# EAGLE design Lion1_2 (EAGLE 6.6.0)
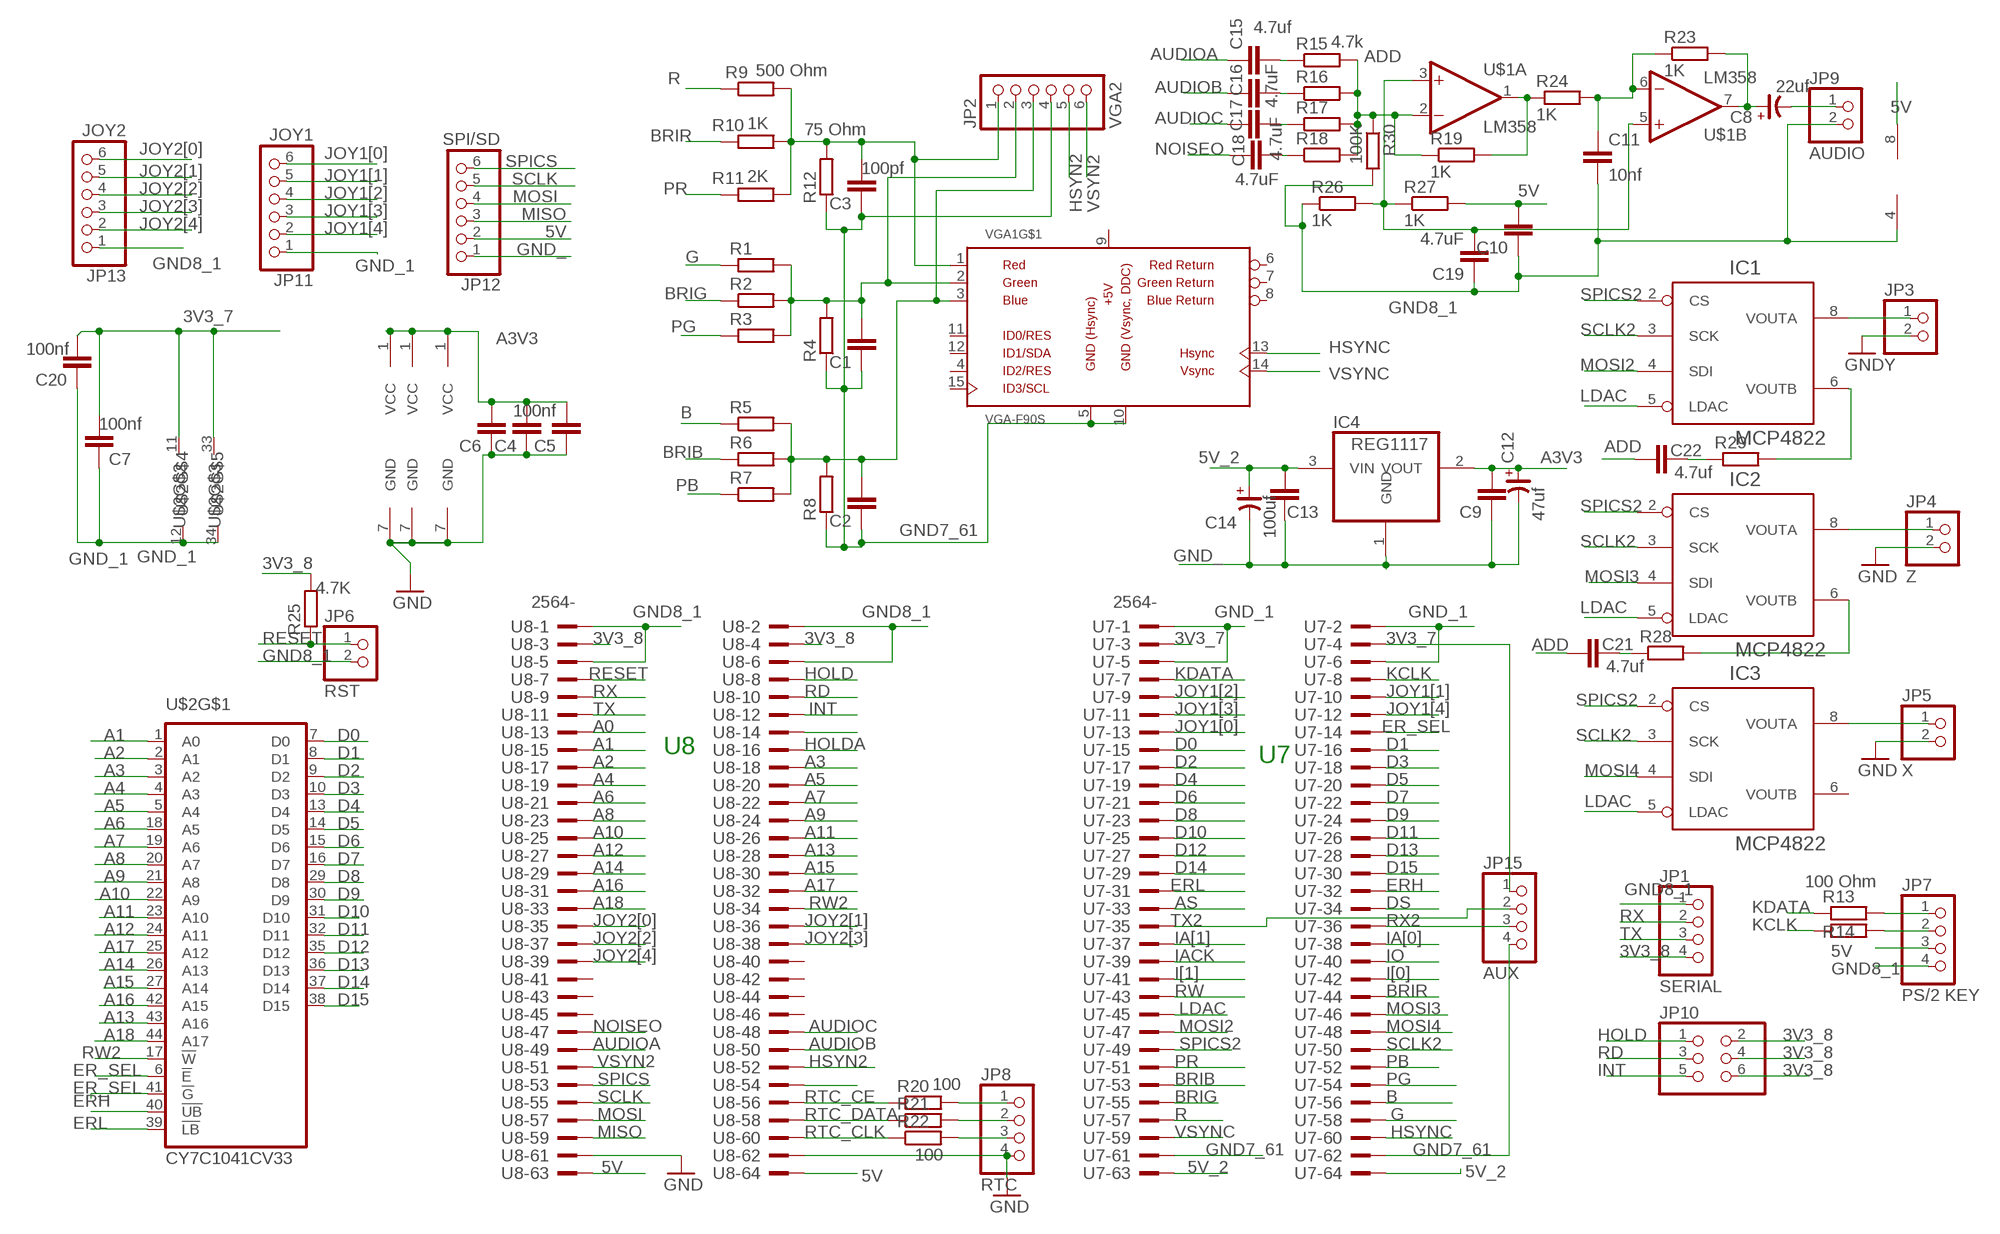
[diagram p0: schematic, sheet 1]

## Parts
C1  C-EU050-025X075  [C050-025X075]
C2  C-EU050-025X075  [C050-025X075]
C3  100pf  C-EU050-025X075  [C050-025X075]
C4  C-EU050-025X075  [C050-025X075]
C5  100nf  C-EU050-025X075  [C050-025X075]
C6  C-EU050-025X075  [C050-025X075]
C7  100nf  C-EUC0805  [C0805]
C8  22uf  CP_E-025X060  [CE-025X060]
C9  C-EU050-025X075  [C050-025X075]
C10  C-EU050-025X075  [C050-025X075]
C11  10nf  C-EU050-025X075  [C050-025X075]
C12  47uf  CP_E-025X060  [CE-025X060]
C13  C-EU050-025X075  [C050-025X075]
C14  100uf  CP_E-025X060  [CE-025X060]
C15  4.7uf  C-EU050-025X075  [C050-025X075]
C16  4.7uF  C-EU050-025X075  [C050-025X075]
C17  4.7uF  C-EU050-025X075  [C050-025X075]
C18  4.7uF  C-EU050-025X075  [C050-025X075]
C19  4.7uF  C-EU050-025X075  [C050-025X075]
C20  100nf  C-EUC0805  [C0805]
C21  4.7uf  C-EU050-025X075  [C050-025X075]
C22  4.7uf  C-EU050-025X075  [C050-025X075]
IC1  MCP4822  MCP42E-P  [DIL08]
IC2  MCP4822  MCP42E-P  [DIL08]
IC3  MCP4822  MCP42E-P  [DIL08]
IC4  REG1117  [SOT223]
JP1  SERIAL  PINHD-1X4  [1X04]
JP2  VGA2  PINHD-1X6  [1X06]
JP3  Y  PINHD-1X2  [1X02]
JP4  Z  PINHD-1X2  [1X02]
JP5  X  PINHD-1X2  [1X02]
JP6  RST  PINHD-1X2  [1X02]
JP7  PS/2 KEY  PINHD-1X4  [1X04]
JP8  RTC  PINHD-1X4  [1X04]
JP9  AUDIO  PINHD-1X2  [1X02]
JP10  PINHD-2X3  [2X03]
JP11  JOY1  PINHD-1X6  [1X06]
JP12  SPI/SD  PINHD-1X6  [1X06]
JP13  JOY2  PINHD-1X6  [1X06]
JP15  AUX  PINHD-1X4  [1X04]
R1  R-EU_0204/7  [0204/7]
R2  R-EU_0204/7  [0204/7]
R3  R-EU_0204/7  [0204/7]
R4  R-EU_0204/7  [0204/7]
R5  R-EU_0204/7  [0204/7]
R6  R-EU_0204/7  [0204/7]
R7  R-EU_0204/7  [0204/7]
R8  R-EU_0204/7  [0204/7]
R9  500 Ohm  R-EU_0204/7  [0204/7]
R10  1K  R-EU_0204/7  [0204/7]
R11  2K  R-EU_0204/7  [0204/7]
R12  75 Ohm  R-EU_0204/7  [0204/7]
R13  100 Ohm  R-EU_0204/7  [0204/7]
R14  R-EU_0204/7  [0204/7]
R15  4.7k  R-EU_0204/2V  [0204V]
R16  R-EU_0204/2V  [0204V]
R17  R-EU_0204/2V  [0204V]
R18  R-EU_0204/2V  [0204V]
R19  1K  R-EU_0204/7  [0204/7]
R20  100  R-EU_0204/7  [0204/7]
R21  100  R-EU_0204/7  [0204/7]
R22  R-EU_0204/7  [0204/7]
R23  1K  R-EU_0204/7  [0204/7]
R24  1K  R-EU_0204/7  [0204/7]
R25  4.7K  R-EU_0204/5  [0204/5]
R26  1K  R-EU_0204/7  [0204/7]
R27  1K  R-EU_0204/7  [0204/7]
R28  R-EU_0204/2V  [0204V]
R29  R-EU_0204/2V  [0204V]
R30  100K  R-EU_0204/7  [0204/7]
U7  2564-  [PAK100/2500-64]
U8  2564-  [PAK100/2500-64]
U$1  LM358  [DIL8]
U$2  CY7C1041CV33  [TSOP44-II]
VGA1  VGA-F90S  [DB-15-F90+SHIELD-SMALL_PADS]

## Nets
3V3_7: C7.2 C20.2 JP15.1 U7.3 U7.4 U$2.11(VCC) U$2.33(VCC)
3V3_8: JP1.4 JP10.2 JP10.4 JP10.6 R25.2 U8.3 U8.4
5V: C10.2 JP7.3 JP12.2 R27.2 U8.63 U8.64 U$1.8(P:V+)
5V_2: C13.2 C14.+ IC4.3(VIN) U7.63 U7.64
A0: U8.13
A1: U8.15 U$2.1(A0)
A2: U8.17 U$2.2(A1)
A3: U8.18 U$2.3(A2)
A3V3: C4.2 C5.2 C6.2 C9.2 C12.+ IC1.1(VCC) IC2.1(VCC) IC3.1(VCC) IC4.2(VOUT)
A4: U8.19 U$2.4(A3)
A5: U8.20 U$2.5(A4)
A6: U8.21 U$2.18(A5)
A7: U8.22 U$2.19(A6)
A8: U8.23 U$2.20(A7)
A9: U8.24 U$2.21(A8)
A10: U8.25 U$2.22(A9)
A11: U8.26 U$2.23(A10)
A12: U8.27 U$2.24(A11)
A13: U8.28 U$2.43(A16)
A14: U8.29 U$2.26(A13)
A15: U8.30 U$2.27(A14)
A16: U8.31 U$2.42(A15)
A17: U8.32 U$2.25(A12)
A18: U8.33 U$2.44(A17)
ADD: C21.1 C22.1 R15.2 R16.2 R17.2 R18.2 R19.1 R30.1 U$1.2(A:-IN)
AS: U7.33
AUDIOA: C15.1 U8.49
AUDIOB: C16.1 U8.50
AUDIOC: C17.1 U8.48
B: R5.1 U7.56
BRIB: R6.1 U7.53
BRIG: R2.1 U7.55
BRIR: R10.1 U7.44
D0: U7.15 U$2.7(D0)
D1: U7.16 U$2.8(D1)
D2: U7.17 U$2.9(D2)
D3: U7.18 U$2.10(D3)
D4: U7.19 U$2.13(D4)
D5: U7.20 U$2.14(D5)
D6: U7.21 U$2.15(D6)
D7: U7.22 U$2.16(D7)
D8: U7.23 U$2.29(D8)
D9: U7.24 U$2.30(D9)
D10: U7.25 U$2.31(D10)
D11: U7.26 U$2.32(D11)
D12: U7.27 U$2.35(D12)
D13: U7.28 U$2.36(D13)
D14: U7.29 U$2.37(D14)
D15: U7.30 U$2.38(D15)
DS: U7.34
ER_SEL: U7.14 U$2.6(!E) U$2.41(!G)
ERH: U7.32 U$2.40(!UB)
ERL: U7.31 U$2.39(!LB)
G: R1.1 U7.58
GND7_61: C1.1 C2.1 C3.1 JP2.4 JP15.4 R4.1 R8.1 R12.1 U7.61 U7.62 VGA1.5(GND) VGA1.10(GND)
GND8_1: C10.1 C11.2 C19.1 JP1.1 JP6.2 JP7.4 JP9.2 JP13.1 R26.1 R30.2 U8.1 U8.2 U8.5 U8.6 U$1.4(P:V-)
GND_: C4.1 C5.1 C6.1 C9.1 C12.- C13.1 C14.- IC1.7(GND) IC2.7(GND) IC3.7(GND) IC4.1(GND) JP3.2 JP4.2 JP5.2 JP8.4 JP12.1 U8.61 U8.62 ; supply symbol labelled GND
GND_1: C7.1 C20.1 JP11.1 U7.1 U7.2 U7.5 U7.6 U$2.12(VSS) U$2.34(VSS)
HOLD: JP10.1 U8.8
HOLDA: U8.16
HSYN2: JP2.5 U8.52
HSYNC: U7.60 VGA1.13(VGA-HSYNC)
I[0]: U7.42
I[1]: U7.41
IA[0]: U7.38
IA[1]: U7.37
IACK: U7.39
INT: JP10.5 U8.12
IO: U7.40
JOY1[0]: JP11.6 U7.13
JOY1[1]: JP11.5 U7.10
JOY1[2]: JP11.4 U7.9
JOY1[3]: JP11.3 U7.11
JOY1[4]: JP11.2 U7.12
JOY2[0]: JP13.6 U8.35
JOY2[1]: JP13.5 U8.36
JOY2[2]: JP13.4 U8.37
JOY2[3]: JP13.3 U8.38
JOY2[4]: JP13.2 U8.39
KCLK: R14.1 U7.8
KDATA: R13.1 U7.7
LDAC: IC1.5(LDAC) IC2.5(LDAC) IC3.5(LDAC) U7.45
MISO: JP12.3 U8.59
MOSI: JP12.4 U8.57
MOSI2: IC1.4(SDI) U7.47
MOSI3: IC2.4(SDI) U7.46
MOSI4: IC3.4(SDI) U7.48
N$1: C1.2 JP2.2 R1.2 R2.2 R3.2 R4.2 VGA1.2(VGA-G)
N$2: IC2.6(VOUTB) R28.2
N$3: C19.2 R26.2 R27.1 U$1.3(A:+IN) U$1.5(B:+IN)
N$4: C15.2 R15.1
N$5: IC3.8(VOUTA) JP5.1
N$6: C2.2 JP2.3 R5.2 R6.2 R7.2 R8.2 VGA1.3(VGA-B)
N$7: IC2.8(VOUTA) JP4.1
N$8: IC1.8(VOUTA) JP3.1
N$9: C21.2 R28.1
N$10: C3.2 JP2.1 R9.2 R10.2 R11.2 R12.2 VGA1.1(VGA-R)
N$11: R19.2 R24.1 U$1.1(A:OUT)
N$12: JP7.1 R13.2
N$13: JP7.2 R14.2
N$14: C8.- JP9.1
N$15: JP8.1 R20.2
N$17: JP8.2 R21.2
N$18: JP8.3 R22.2
N$19: C8.+ R23.2 U$1.7(B:OUT)
N$20: C11.1 R23.1 R24.2 U$1.6(B:-IN)
N$21: C16.2 R16.1
N$22: C17.2 R17.1
N$23: C18.2 R18.1
N$25: C22.2 R29.1
N$26: IC1.6(VOUTB) R29.2
N$47: U8.14
N$66: U8.54
NOISEO: C18.1 U8.47
PB: R7.1 U7.52
PG: R3.1 U7.54
PR: R11.1 U7.51
R: R9.1 U7.57
RD: JP10.3 U8.10
RESET: JP6.1 R25.1 U8.7
RTC_CE: R20.1 U8.56
RTC_CLK: R22.1 U8.60
RTC_DATA: R21.1 U8.58
RW: U7.43
RW2: U8.34 U$2.17(!W)
RX: JP1.2 U8.9
RX2: JP15.3 U7.36
SCLK: JP12.5 U8.55
SCLK2: IC1.3(SCK) IC2.3(SCK) IC3.3(SCK) U7.50
SPICS: JP12.6 U8.53
SPICS2: IC1.2(CS) IC2.2(CS) IC3.2(CS) U7.49
TX: JP1.3 U8.11
TX2: JP15.2 U7.35
VSYN2: JP2.6 U8.51
VSYNC: U7.59 VGA1.14(VGA-VSYNC)
Unconnected: IC3.6(VOUTB) U8.40 U8.41 U8.42 U8.43 U8.44 U8.45 U8.46 VGA1.4(ID2/RES) VGA1.6(VGA-R-) VGA1.7(VGA-G-) VGA1.8(VGA-B-) VGA1.11(ID0/RES) VGA1.12(ID1/SDA) VGA1.15(ID3/SCL) VGA1.SHIELD@1(SHIELD) VGA1.SHIELD@2(SHIELD)

## Notes on the sheet
- U8
- U7

## Power pins joined to a net without a drawn wire
+5V: VGA1.9(+5V)

## Library data of the parts
C1-C7 C9-C11 C13 C15-C22 = rcl:C-EU: CAPACITOR, European symbol
C8 C12 C14 = rc-master:CP_: POLARIZED CAP
IC1-IC3 = dac:MCP4*2: DAC 8BIT DUAL SPI/VREF
IC4 = burr-brown:REG1117: 800mA and 1A Low Dropout (LDO) Positive Regulator 1.8V, 2.5V, 2.85V, 3.3V, 5V, and Adj; MPN: REG1117; OC_FARNELL: 1097566; OC_NEWARK: 14P6981
JP1 JP7 JP8 JP15 = pinhead:PINHD-1X4: PIN HEADER
JP2 JP11-JP13 = pinhead:PINHD-1X6: PIN HEADER
JP3-JP6 JP9 = pinhead:PINHD-1X2: PIN HEADER
JP10 = pinhead:PINHD-2X3: PIN HEADER
R1-R12 R25 = rcl:R-EU_: RESISTOR, European symbol
R13-R24 R26-R30 = SmartPrj:R-EU_: RESISTOR, European symbol
U7 U8 = con-3m:2564-: 3M (TM) Pak 100 4-Wall Header Source: 3M; OC_FARNELL: unknown; OC_NEWARK: unknown
U$1 = eagle-6.5.0-atari:LM358: Dual General Purpose, Rail-to-Rail Output Operational Amplifier
U$2 = st-microelectronics:CY7C1041CV33
VGA1 = VideoConnectors:VGA-*

## Board
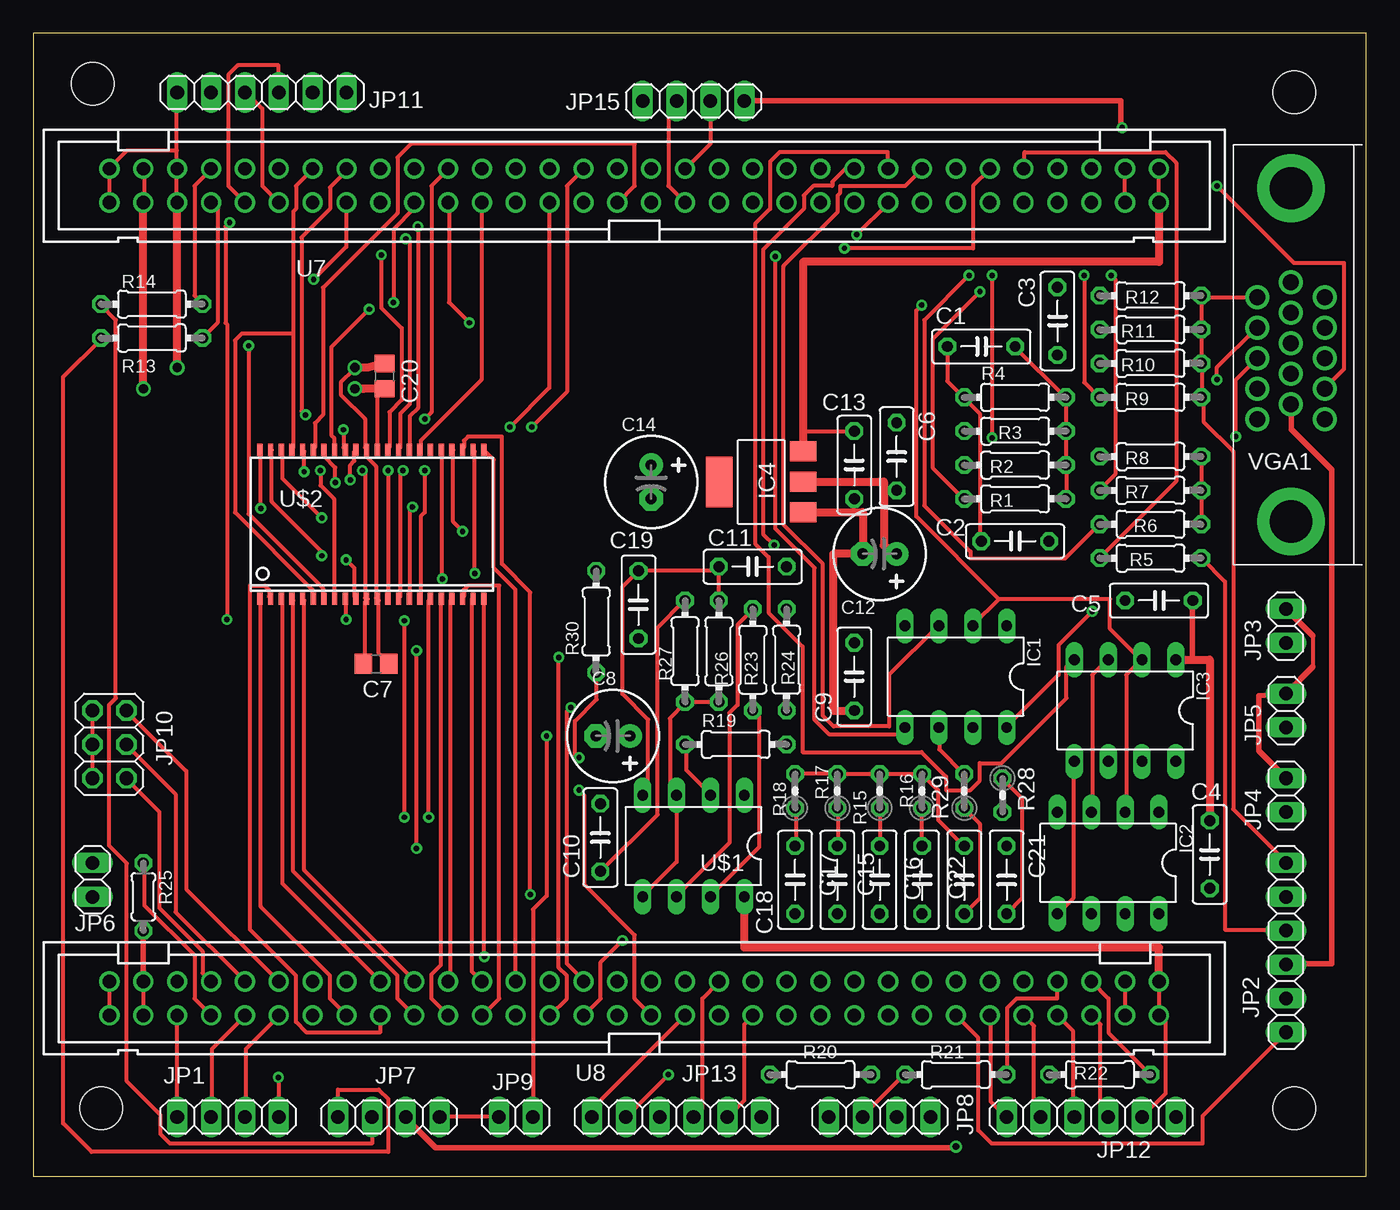
[diagram p1: board, top side]
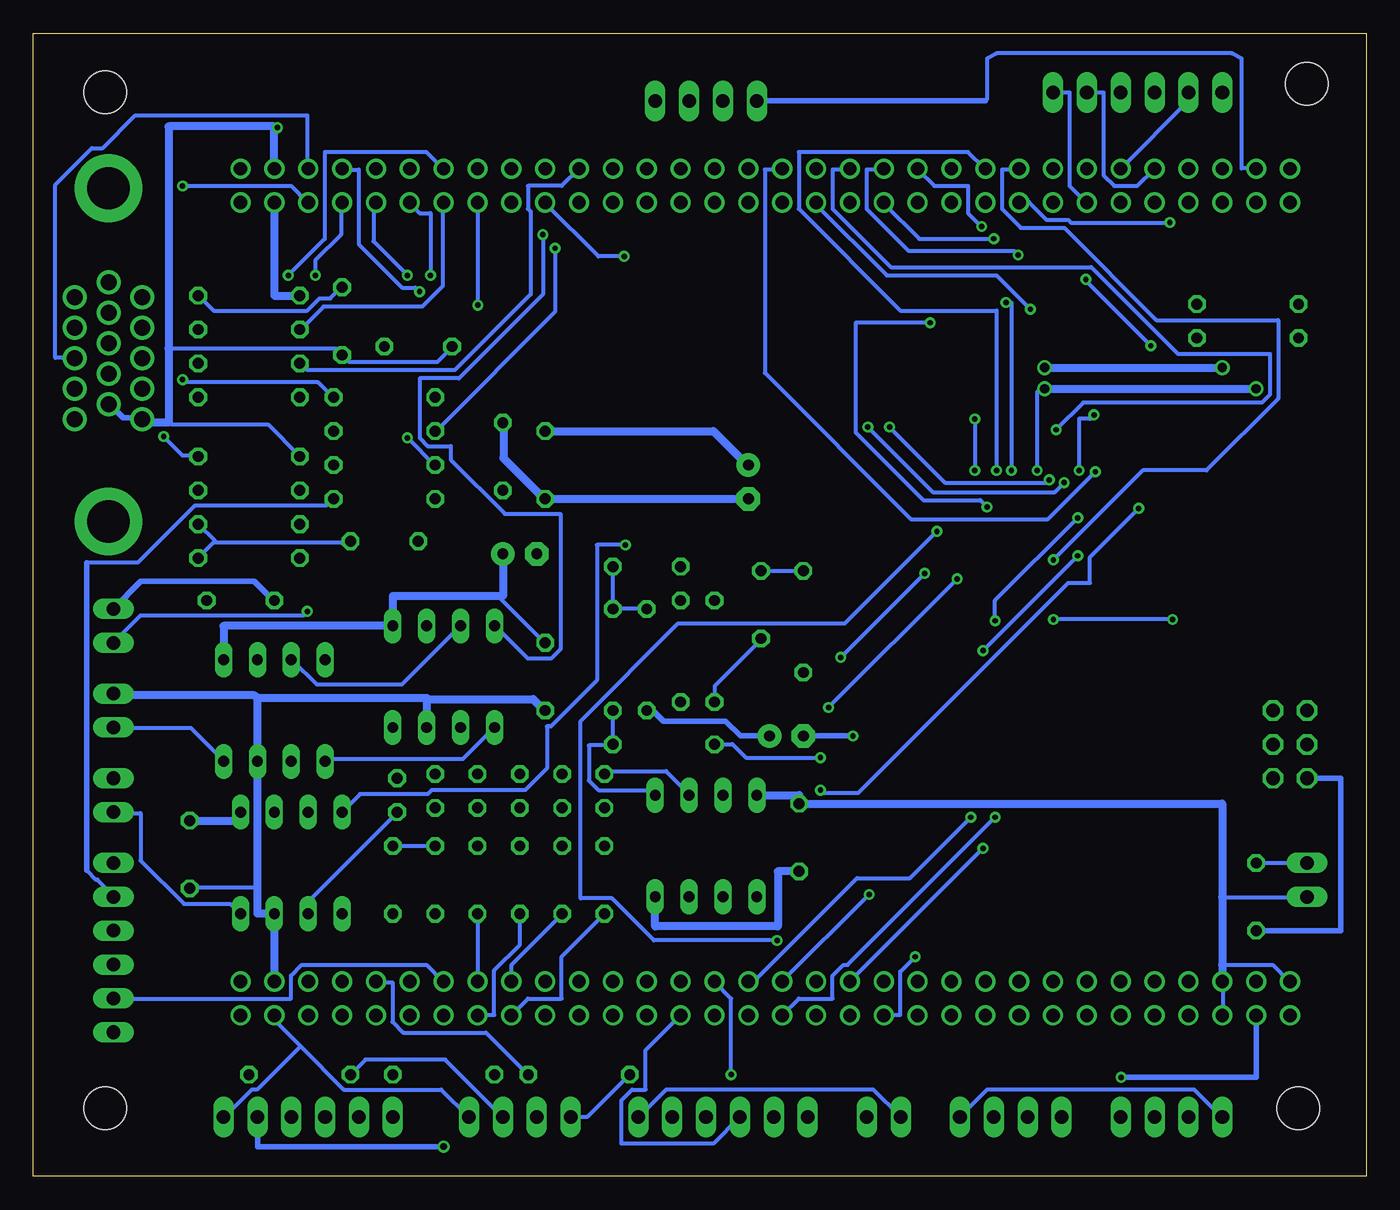
[diagram p2: board, bottom side, seen from below]

Size 100 x 85.72 mm. Coordinates in mm from the lower left corner, seen from the top.
Outline: 0,0 100,0 100,85.72 0,85.72 0,0
Copper layers (1*16): Top 0.035mm / dielectric 1.5mm / Bottom 0.035mm
Design rules "default *": minimum track width 12mil, minimum drill 16mil, track to track 12mil, track to pad 12mil, pad to pad 12mil, via to via 12mil, smd to smd 6mil, copper to edge 40mil, drill to drill 16mil, minimum pad ring 10mil, minimum via ring 8mil, stop-mask expansion 4mil, vias tented up to drill 0mil, thermal gap 10mil
Holes 3.2 mm at 94.61,81.28 94.61,5.08 4.45,81.92 5.08,5.08

### Footprints (pad centres in the part's own frame; a part is rotated, then mirrored left to right if it is on the bottom)
C050-025X075 = drill 0.813 octagon: 1 -2.54,0; 2 2.54,0
C0805 = smd 1.3 x 1.5: 1 -0.95,0; 2 0.95,0
CE-025X060 = drill 0.813 pad 1.778: + -1.27,0 | drill 0.813 pad 1.778 octagon: - 1.27,0
DIL08 = drill 0.813 long: 1 -3.81,-3.81; 2 -1.27,-3.81; 3 1.27,-3.81; 4 3.81,-3.81; 5 3.81,3.81; 6 1.27,3.81; 7 -1.27,3.81; 8 -3.81,3.81
SOT223 = smd 1.499 x 2.007: 1 -2.261,-3.15; 2 0.025,-3.15; 3 2.311,-3.15 | smd 3.81 x 2.007: 4 0,3.15
1X04 = drill 1.016 long: 1 -3.81,0; 2 -1.27,0; 3 1.27,0; 4 3.81,0
1X06 = drill 1.016 long: 1 -6.35,0; 2 -3.81,0; 3 -1.27,0; 4 1.27,0; 5 3.81,0; 6 6.35,0
1X02 = drill 1.016 long: 1 -1.27,0; 2 1.27,0
2X03 = drill 1.016 octagon: 1 -2.54,-1.27; 2 -2.54,1.27; 3 0,-1.27; 4 0,1.27; 5 2.54,-1.27; 6 2.54,1.27
0204/7 = drill 0.813 octagon: 1 -3.81,0; 2 3.81,0
0204V = drill 0.813 octagon: 1 -1.27,0; 2 1.27,0
0204/5 = drill 0.813 octagon: 1 -2.54,0; 2 2.54,0
PAK100/2500-64 = drill 1 pad 1.422: 1 -39.37,-1.27; 2 -39.37,1.27; 3 -36.83,-1.27; 4 -36.83,1.27; 5 -34.29,-1.27; 6 -34.29,1.27; 7 -31.75,-1.27; 8 -31.75,1.27; 9 -29.21,-1.27; 10 -29.21,1.27; 11 -26.67,-1.27; 12 -26.67,1.27; 13 -24.13,-1.27; 14 -24.13,1.27; 15 -21.59,-1.27; 16 -21.59,1.27; 17 -19.05,-1.27; 18 -19.05,1.27; 19 -16.51,-1.27; 20 -16.51,1.27; 21 -13.97,-1.27; 22 -13.97,1.27; 23 -11.43,-1.27; 24 -11.43,1.27; 25 -8.89,-1.27; 26 -8.89,1.27; 27 -6.35,-1.27; 28 -6.35,1.27; 29 -3.81,-1.27; 30 -3.81,1.27; 31 -1.27,-1.27; 32 -1.27,1.27; 33 1.27,-1.27; 34 1.27,1.27; 35 3.81,-1.27; 36 3.81,1.27; 37 6.35,-1.27; 38 6.35,1.27; 39 8.89,-1.27; 40 8.89,1.27; 41 11.43,-1.27; 42 11.43,1.27; 43 13.97,-1.27; 44 13.97,1.27; 45 16.51,-1.27; 46 16.51,1.27; 47 19.05,-1.27; 48 19.05,1.27; 49 21.59,-1.27; 50 21.59,1.27; 51 24.13,-1.27; 52 24.13,1.27; 53 26.67,-1.27; 54 26.67,1.27; 55 29.21,-1.27; 56 29.21,1.27; 57 31.75,-1.27; 58 31.75,1.27; 59 34.29,-1.27; 60 34.29,1.27; 61 36.83,-1.27; 62 36.83,1.27; 63 39.37,-1.27; 64 39.37,1.27
DIL8 = drill 0.813 long: 1 -3.81,-3.81; 2 -1.27,-3.81; 3 1.27,-3.81; 4 3.81,-3.81; 5 3.81,3.81; 6 1.27,3.81; 7 -1.27,3.81; 8 -3.81,3.81
TSOP44-II = smd 0.4 x 0.9: 1 -8.4,-5.6; 2 -7.6,-5.6; 3 -6.8,-5.6; 4 -6,-5.6; 5 -5.2,-5.6; 6 -4.4,-5.6; 7 -3.6,-5.6; 8 -2.8,-5.6; 9 -2,-5.6; 10 -1.2,-5.6; 11 -0.4,-5.6; 12 0.4,-5.6; 13 1.2,-5.6; 14 2,-5.6; 15 2.8,-5.6; 16 3.6,-5.6; 17 4.4,-5.6; 18 5.2,-5.6; 19 6,-5.6; 20 6.8,-5.6; 21 7.6,-5.6; 22 8.4,-5.6; 23 8.4,5.6; 24 7.6,5.6; 25 6.8,5.6; 26 6,5.6; 27 5.2,5.6; 28 4.4,5.6; 29 3.6,5.6; 30 2.8,5.6; 31 2,5.6; 32 1.2,5.6; 33 0.4,5.6; 34 -0.4,5.6; 35 -1.2,5.6; 36 -2,5.6; 37 -2.8,5.6; 38 -3.6,5.6; 39 -4.4,5.6; 40 -5.2,5.6; 41 -6,5.6; 42 -6.8,5.6; 43 -7.6,5.6; 44 -8.4,5.6
DB-15-F90+SHIELD-SMALL_PADS = drill 1.2 pad 1.524: 1 4.318,14.224; 2 2.032,14.224; 3 -0.254,14.224; 4 -2.54,14.224; 5 -4.826,14.224; 6 5.461,11.684; 7 3.175,11.684; 8 0.889,11.684; 9 -1.397,11.684; 10 -3.683,11.684; 11 4.318,9.144; 12 2.032,9.144; 13 -0.254,9.144; 14 -2.54,9.144; 15 -4.826,9.144 | drill 3.175 pad 5.08: SHIELD@1 -12.497,11.684; SHIELD@2 12.497,11.684

### Placement (x,y rotation side)
C1  71.12,62.23 0 top
C2  73.66,47.62 0 top
C3  76.83,64.14 90 top
C4  88.27,24.13 90 top
C5  84.45,43.18 0 top
C6  64.77,53.98 270 top
C7  25.72,38.42 180 top
C8  43.5,33.02 180 top
C9  61.59,37.47 90 top
C10  42.55,25.4 270 top
C11  53.98,45.72 180 top
C12  63.5,46.67 180 top
C13  61.59,53.34 90 top
C14  46.35,52.07 270 top
C15  63.5,22.23 90 top
C16  66.67,22.23 90 top
C17  60.33,22.23 90 top
C18  57.15,22.23 90 top
C19  45.4,42.86 270 top
C20  26.35,60.01 270 top
C21  73.03,22.23 270 top
C22  69.85,22.23 270 top
IC1  69.22,37.47 180 top
IC2  80.64,23.5 180 top
IC3  81.92,34.92 180 top
IC4  54.61,52.07 90 top
JP1  14.61,4.45 0 top
JP2  93.98,17.14 270 top
JP3  93.98,41.27 90 top
JP4  93.98,28.57 90 top
JP5  93.98,34.92 90 top
JP6  4.45,22.23 270 top
JP7  26.67,4.45 0 top
JP8  63.5,4.45 0 top
JP9  36.2,4.45 180 top
JP10  5.71,32.38 90 top
JP11  17.14,81.28 0 top
JP12  79.38,4.45 180 top
JP13  48.26,4.45 180 top
JP15  49.53,80.64 0 top
R1  73.66,50.8 0 top
R2  73.66,53.34 0 top
R3  73.66,55.88 0 top
R4  73.66,58.42 0 top
R5  83.82,46.35 0 top
R6  83.82,48.9 0 top
R7  83.82,51.44 0 top
R8  83.82,53.98 0 top
R9  83.82,58.42 0 top
R10  83.82,60.96 0 top
R11  83.82,63.5 0 top
R12  83.82,66.04 0 top
R13  8.89,62.87 180 top
R14  8.89,65.41 180 top
R15  63.5,28.89 90 top
R16  66.67,28.89 90 top
R17  60.33,28.89 90 top
R18  57.15,28.89 90 top
R19  52.7,32.38 0 top
R20  59.05,7.62 180 top
R21  69.22,7.62 180 top
R22  80.01,7.62 180 top
R23  53.98,38.73 270 top
R24  56.52,38.73 90 top
R25  8.26,20.95 270 top
R26  51.44,39.37 270 top
R27  48.9,39.37 90 top
R28  72.71,28.57 270 top
R29  69.85,28.89 90 top
R30  42.23,41.59 90 top
U7  45.09,74.3 0 top
U8  45.09,13.34 0 top
U$1  49.53,24.77 180 top
U$2  25.4,48.9 0 top
VGA1  106.05,61.59 90 top

### Tracks (layer width: path | path; a pad name or v marks a point on that pad's centre or on a via)
3V3_7  (via drill 0.41, 0.7)
  Top 0.305: U$2.11 25.08,43.3 | U$2.11 24.99,43.18 24.89,43.08 24.89,38.61 24.79,38.51 C7.2 | U$2.33 25.81,54.56 25.81,58.83 C20.2 | U7.3 8.33,73.25 8.33,75.49 U7.4 | v24.69,52.93 24.89,52.73 24.89,43.38 U$2.11
  Top 0.61: C20.2 24.77,59.05 v24.13,59.05 | v8.26,59.05 U7.3
  Bottom 0.305: v24.69,52.93 24.69,58.83 24.28,58.83 v24.13,59.05 | 28.57,80.64 28.45,80.77 28.45,83.82 27.74,84.21 10.06,84.21 9.35,83.82 9.35,75.59 8.33,75.59 U7.4
  Bottom 0.406: JP15.1 28.57,80.64
  Bottom 0.61: v24.13,59.05 v8.26,59.05
3V3_8  (via drill 0.41)
  Top 0.305: U8.3 8.23,12.09 8.23,14.53 U8.4 | 4.47,34.85 JP10.6 4.47,34.75 4.47,32.51 JP10.4 4.47,32.31 4.47,29.87 JP10.2 | v18.39,7.42 18.39,4.47 JP1.4
  Top 0.406: R25.2 U8.4
  Bottom 0.406: R25.2 1.91,18.41 1.91,29.84 JP10.2 | U8.3 8.26,7.43 v18.39,7.43 v18.39,7.42
5V  (via drill 0.5)
  Top 0.305: R27.2 48.87,43.18 46.84,41.15 46.84,27.13 42.57,22.86 C10.2 | U8.64 84.43,14.33 84.43,12.09 U8.63 84.94,11.58 84.94,6.2 JP12.2 | 27.94,4.37 JP7.3 | 69.22,2.12 v69.22,2.22
  Top 0.406: 27.94,4.37 30.19,2.12 69.22,2.12
  Top 0.61: U8.64 84.45,17.14 53.34,17.14 U$1.8
  Bottom 0.406: v69.22,2.22 83.19,2.22 JP12.2
  Bottom 0.61: C10.2 44.13,22.86 44.13,18.73 53.34,18.73 U$1.8
5V_2
  Top 0.305: 57.76,55.88 C13.2 | U7.64 84.43,75.49 84.43,73.25 U7.63
  Top 0.61: U7.63 84.45,68.58 57.76,68.58 57.76,55.88 IC4.3
  Bottom 0.305: 46.43,53.34 C14.+
  Bottom 0.61: 46.43,53.34 48.97,55.88 C13.2
A1
  Top 0.305: U8.15 22.25,13.31 22.25,15.04 17.07,20.22 17.07,43.28 U$2.1
A2
  Top 0.305: U$2.2 17.78,43.38 17.68,43.48 17.68,43.99 17.37,44.3 16.26,44.3 16.26,18.49 19.71,15.04 19.71,11.58 20.52,10.77 26.01,10.77 26.01,11.99 U8.17
A3
  Top 0.305: U8.18 18.69,21.95 18.69,43.28 U$2.3
A3V3
  Top 0.305: 63.82,51.41 64.72,51.41 C6.2 | 86.97,43.18 C5.2
  Top 0.406: 86.97,38.73 86.97,43.18
  Top 0.61: IC3.1 86.97,38.73 88.27,38.73 C4.2 | IC4.2 63.82,52.09 63.82,51.41 63.82,47.31 C12.+
  Bottom 0.305: C9.2 61.67,40.03 64.92,43.28 64.77,43.5
  Bottom 0.61: C12.+ 64.77,43.5 73.03,43.5 IC1.1 85.72,41.27 IC3.1 | C4.2 84.45,26.67 IC2.1
A4
  Top 0.305: U8.19 27.33,13.31 27.33,15.04 19.51,22.86 19.51,43.18 19.41,43.28 U$2.4
A5
  Top 0.305: U$2.5 20.22,43.28 20.32,43.18 20.32,22.96 28.55,14.73 28.55,14.63 U8.20
A6
  Top 0.305: U8.21 29.87,13.31 29.87,15.14 30.58,15.85 30.58,43.28 U$2.18
A7
  Top 0.305: U$2.19 31.39,43.28 31.29,43.18 31.29,14.73 31.19,14.63 U8.22
A8
  Top 0.305: U$2.20 32.21,43.38 32.31,43.48 32.31,43.99 32.61,44.3 34.95,44.3 34.95,13.31 33.73,12.09 U8.23
A9
  Top 0.305: U8.24 32.92,15.34 32.92,43.28 U$2.21
A10  (via drill 0.41)
  Top 0.305: v33.83,16.46 33.83,43.28 U$2.22
  Bottom 0.305: v33.83,16.46 34.95,15.34 34.95,12.09 36.17,12.09 U8.25
A11
  Top 0.305: U$2.23 33.83,54.46 34.54,53.75 34.54,45.62 36.17,43.99 36.17,14.63 U8.26
A12  (via drill 0.41)
  Top 0.305: v33.12,45.21 33.12,54.36 33.02,54.46 U$2.24 | v39.42,38.91 39.42,15.65 40.03,15.04 40.03,13.31 38.81,12.09 U8.27
  Bottom 0.305: v39.42,38.91 v33.12,45.21
A13  (via drill 0.41)
  Top 0.305: v21.64,46.53 21.64,46.84 17.88,50.6 17.88,54.46 U$2.43 | v28.75,24.59 v28.75,39.42
  Bottom 0.305: v28.75,39.42 v21.64,46.53 | U8.28 v28.75,24.59
A14  (via drill 0.41)
  Top 0.305: v32.21,48.36 31.5,49.07 31.5,54.46 U$2.26 | v44.2,17.68 42.57,16.05 42.57,13.31 41.35,12.09 U8.29
  Bottom 0.305: v32.21,48.36 39.12,41.45 51.61,41.45 58.93,34.14 58.93,20.83 56.59,20.83 53.44,17.68 v44.2,17.68
A15  (via drill 0.41)
  Top 0.305: v30.68,44.81 30.68,54.46 U$2.27 | v40.34,35.15 40.03,34.85 40.03,15.95 41.25,14.73 41.25,14.63 U8.30
  Bottom 0.305: v40.34,35.15 v30.68,44.81
A16  (via drill 0.41)
  Top 0.305: v21.64,49.38 18.69,52.32 18.69,54.46 U$2.42 | v27.84,26.92 v27.84,41.66
  Bottom 0.305: v21.64,49.38 27.84,43.18 v27.84,41.66 | v27.84,26.92 38.91,15.85 39.22,15.85 40.03,15.04 40.03,13.31 42.57,13.31 U8.31
A17  (via drill 0.41)
  Top 0.305: v37.29,21.13 37.29,43.79 35.15,45.92 35.15,55.47 32.61,55.47 32.31,55.17 32.31,54.66 32.21,54.56 U$2.25
  Bottom 0.305: U8.32 v37.29,21.13
A18  (via drill 0.41)
  Top 0.305: v17.07,50.09 17.07,54.46 U$2.44 | v40.95,28.96 41.35,28.55 41.35,21.84 45.11,18.09 45.11,13.31 U8.33
  Bottom 0.305: v17.07,50.09 20.73,46.43 20.73,44.5 22.35,44.5 38.1,28.75 40.74,28.75 v40.95,28.96
ADD  (via drill 0.41)
  Top 0.305: U$1.2 50.8,28.65 48.97,30.48 48.97,32.31 R19.1 | R18.2 57.2,30.18 60.25,30.18 R17.2 60.45,30.18 63.5,30.18 R15.2 63.6,30.18 66.65,30.18 R16.2 66.75,30.07 67.87,28.96 67.87,26.72 69.8,24.79 C22.1 | v40.95,31.39 40.74,31.39 40.64,31.5 40.64,34.14 42.27,35.76 42.27,37.69 R30.1
  Bottom 0.305: C22.1 69.9,24.79 72.95,24.79 C21.1 | U$1.2 50.8,28.65 52.53,30.38 56.9,30.38 57.1,30.18 R18.2 | v40.95,31.39 46.53,31.39 47.55,32.41 48.87,32.41 R19.1
AUDIOA
  Bottom 0.305: C15.1 63.5,17.37 65.43,15.44 65.43,12.09 66.65,12.09 U8.49
AUDIOB
  Bottom 0.305: C16.1 66.65,19.61 66.65,14.63 U8.50
AUDIOC
  Bottom 0.305: C17.1 60.35,19.61 64.11,15.85 64.11,14.63 U8.48
B
  Top 0.305: R5.1 80.06,46.43 85.75,52.12 85.75,76 84.94,76.81 74.37,76.81 74.37,75.59 U7.56
BRIB  (via drill 0.41)
  Top 0.305: v70.21,67.56 66.85,64.21 66.85,50.29 70.31,46.84 70.31,46.33 77.42,46.33 79.96,48.87 R6.1
  Bottom 0.305: v70.21,67.56 70.21,72.24 71.02,72.24 71.73,72.95 U7.53
BRIG  (via drill 0.41)
  Top 0.305: v71.93,67.56 v71.93,55.37
  Bottom 0.305: v71.93,55.37 69.9,53.34 R2.1 | v71.93,67.56 74.47,70.1 74.47,72.95 74.37,72.95 U7.55
BRIR
  Bottom 0.305: U7.44 60.35,74.27 62.89,74.27 62.89,72.54 62.69,72.34 62.69,66.14 68.38,60.45 79.45,60.45 79.96,60.96 R10.1
D0  (via drill 0.41)
  Top 0.305: v16.15,62.28 16.15,49.68 21.74,44.09 21.74,43.38 U$2.7 | v21.03,67.26 23.47,69.7 23.47,72.95 U7.15
  Bottom 0.305: v16.15,62.28 21.03,67.16 v21.03,67.26
D1  (via drill 0.41)
  Top 0.305: v21.54,52.93 21.54,51.82 22.55,50.8 22.55,43.38 U$2.8 | v20.42,57.1 20.12,57.4 20.12,70.41 22.25,72.54 22.25,74.17 23.47,75.39 23.47,75.49 U7.16
  Bottom 0.305: v21.54,52.93 21.54,56.79 20.73,56.79 v20.42,57.1
D2  (via drill 0.41)
  Top 0.305: v23.47,41.76 23.47,43.28 U$2.9 | v14.53,41.76 14.53,63.91 14.43,64.01 14.43,71.22 v14.73,71.53
  Bottom 0.305: v14.53,41.76 v23.47,41.76 | v14.73,71.53 22.15,71.53 22.35,71.73 23.98,71.73 25.3,73.05 26.01,73.05 U7.17
D3  (via drill 0.41)
  Top 0.305: v23.47,46.23 24.08,45.62 24.08,43.48 24.18,43.38 U$2.10
  Bottom 0.305: v23.47,46.23 16.76,52.93 11.99,52.93 6.6,58.32 6.6,64.21 15.75,64.21 22.66,71.12 25.91,71.12 27.33,72.54 27.33,75.49 26.11,75.49 U7.18
D4  (via drill 0.41)
  Top 0.305: v26.62,52.93 26.62,43.38 U$2.13 | v27.03,65.53 27.03,71.02 28.55,72.54 28.55,72.95 U7.19
  Bottom 0.305: v26.62,52.93 26.62,65.53 v27.03,65.53
D5  (via drill 0.41)
  Top 0.305: v27.74,52.93 27.53,52.73 27.53,43.48 27.43,43.38 U$2.14
  Bottom 0.305: v27.74,52.93 27.74,64.92 34.95,64.92 42.57,72.54 42.57,76.81 29.87,76.81 28.65,75.59 U7.20
D6  (via drill 0.41)
  Top 0.305: v28.45,50.19 28.25,49.99 28.25,43.38 U$2.15 | v32.72,64.01 31.19,65.53 31.19,72.95 U7.21
  Bottom 0.305: v28.45,50.19 28.96,50.7 33.22,50.7 38.3,55.78 38.3,64.01 v32.72,64.01
D7  (via drill 0.41)
  Top 0.305: v29.36,52.93 29.36,49.78 29.06,49.48 29.06,43.38 U$2.16 | v29.36,56.79 29.87,57.3 29.87,74.27 31.09,75.49 U7.22
  Bottom 0.305: v29.36,56.79 v29.36,52.93
D8
  Top 0.305: U$2.29 29.06,54.56 29.06,55.17 33.63,59.74 33.63,72.95 U7.23
D9  (via drill 0.41)
  Top 0.305: v28.85,71.22 28.85,57.61 28.25,57 28.25,54.56 U$2.30
  Bottom 0.305: v28.85,71.22 29.87,72.24 29.87,74.27 32.41,74.27 33.63,75.49 U7.24
D10  (via drill 0.41)
  Top 0.305: v27.94,70.31 28.25,70 28.25,57.91 27.53,57.2 27.53,54.66 27.43,54.56 U$2.31
  Bottom 0.305: v27.94,70.31 33.53,70.31 36.17,72.95 U7.25
D11  (via drill 0.41)
  Top 0.305: v26.11,69.09 26.11,65.13 27.64,63.6 27.64,58.22 26.72,57.3 26.72,54.66 26.62,54.56 U$2.32
  Bottom 0.305: v26.11,69.09 26.42,69.39 34.34,69.39 37.49,72.54 37.49,75.49 36.27,75.49 U7.26
D12  (via drill 0.41)
  Top 0.305: v23.77,52.22 23.77,53.34 24.08,53.65 24.08,54.36 24.18,54.46 U$2.35 | v35.76,56.19 38.71,59.13 38.71,72.95 U7.27
  Bottom 0.305: v23.77,52.22 23.98,52.02 31.6,52.02 v35.76,56.19
D13  (via drill 0.41)
  Top 0.305: v23.27,55.98 23.27,54.66 23.37,54.56 U$2.36
  Bottom 0.305: v23.27,55.98 21.23,58.01 7.82,58.01 7.21,58.62 7.21,61.67 14.12,61.67 20.62,68.17 35.66,68.17 40.03,72.54 40.03,75.49 38.81,75.49 U7.28
D14  (via drill 0.41)
  Top 0.305: v25.2,65.02 22.35,62.18 22.35,55.58 22.55,55.37 22.55,54.56 U$2.37
  Bottom 0.305: v25.2,65.02 27.74,67.56 35.97,67.56 41.35,72.95 U7.29
D15  (via drill 0.41)
  Top 0.305: v22.66,52.02 22.66,53.14 21.84,53.95 21.84,54.46 U$2.38 | v37.39,56.19 40.03,58.83 40.03,74.27 41.25,75.49 U7.30
  Bottom 0.305: v22.66,52.02 23.37,51.31 32.51,51.31 v37.39,56.19
ER_SEL
  Top 0.305: 19.51,63.2 19.51,72.34 19.71,72.54 19.71,74.27 20.93,75.49 U7.14 | 19.51,63.2 19.51,54.66 19.41,54.56 U$2.41 | 19.51,63.2 15.65,63.2 15.14,62.69 15.14,49.78 20.93,43.99 20.93,43.38 U$2.6
ERH  (via drill 0.41)
  Top 0.305: v20.32,52.83 20.32,54.36 20.22,54.46 U$2.40
  Bottom 0.305: v20.32,52.83 23.88,49.28 34.14,49.28 45.11,60.25 45.11,75.49 43.89,75.49 U7.32
ERL
  Top 0.305: U$2.39 21.03,54.56 21.13,54.66 21.13,56.49 21.74,57.1 21.74,66.65 27.33,72.24 27.33,76.4 28.35,77.42 45.11,77.42 45.11,74.27 43.89,73.05 U7.31
G  (via drill 0.41)
  Top 0.305: v71.02,66.34 67.46,62.79 67.46,53.14 69.8,50.8 R1.1
  Bottom 0.305: v71.02,66.34 71.32,66.65 72.34,66.65 75.59,69.9 75.59,75.49 76.81,75.49 U7.58
GND7_61  (via drill 0.41)
  Top 0.305: 94.39,57.91 VGA1.10 | C1.1 68.58,59.64 69.8,58.42 R4.1 69.9,58.32 71.02,57.2 71.02,47.75 71.12,47.65 C2.1 | U7.62 81.89,75.49 81.89,73.05 U7.61
  Top 0.406: 94.39,57.91 94.39,56.03 97.43,52.98 97.43,15.95 93.98,15.95 JP2.4 | v81.69,78.64 81.6,78.64 81.6,80.64 JP15.4
  Bottom 0.305: C1.1 68.58,62.18 69.7,61.06 76.3,61.06 C3.1 77.32,62.08 89.85,62.08 | R8.1 80.06,54.05 82.4,56.39 89.61,56.39 89.85,56.52 | 94.28,57.91 VGA1.10 | v81.69,78.64 81.92,78.74
  Bottom 0.406: 94.28,57.91 93.27,56.9 92.05,56.9 VGA1.5
  Bottom 0.61: U7.61 81.92,66.04 R12.1 | U7.62 81.92,78.74 89.85,78.74 89.85,62.08 89.85,56.52 91.82,56.52 VGA1.5
GND8_1
  Top 0.305: JP7.4 30.48,4.47 34.85,4.47 JP9.2 | R26.1 51.41,43.18 51.41,45.72 C11.2 51.31,45.41 45.41,45.41 C19.1 44.2,44.2 44.2,36.17 46.13,34.24 46.13,29.06 45.72,28.65 U$1.4 | U8.1 5.69,12.09 5.69,14.53 U8.2 | JP1.1 10.77,4.47 10.77,11.99 U8.5
  Bottom 0.305: JP9.2 36.98,6.5 52.53,6.5 54.56,4.47 JP13.1 | U8.5 10.77,12.09 10.77,14.33 U8.6 | 10.79,20.93 4.47,20.93 JP6.2 | 10.79,15.85 7.01,15.85 5.79,14.63 U8.2 | JP7.4 30.48,4.47 28.45,6.5 12.9,6.5 10.87,4.47 JP1.1 | R30.2 42.27,45.41 45.31,45.41 C19.1
  Bottom 0.61: U8.6 10.79,15.85 10.79,20.93 10.79,27.94 C10.1 42.55,28.57 U$1.4
GND_
  Top 0.305: 93.98,29.87 JP4.2 | 93.98,36.17 JP5.2 94.08,36.27 | 96.01,40.54 96.01,38.2 | 93.98,42.57 JP3.2 | 61.57,49.81 61.57,50.8 C13.1 | U8.61 81.89,12.09 81.89,14.53 U8.62
  Top 0.406: 93.98,29.87 91.95,31.9 91.95,36.04 93.98,36.17 | 96.01,38.2 94.08,36.27 | 93.98,42.57 96.01,40.54
  Top 0.61: IC4.1 61.57,49.81 62.23,49.81 C12.- 60.01,46.67 60.01,34.92 C9.1
  Bottom 0.305: 93.98,42.57 JP3.2 | 61.67,50.8 C13.1 | 64.72,56.49 C6.1 | 83.19,21.64 88.19,21.64 C4.1 | 79.96,9.75 81.89,11.68 81.89,11.99 U8.61 | 79.96,9.75 76.71,6.5 69.39,6.5 67.36,4.47 JP8.4 | 79.96,9.75 83.21,6.5 83.62,6.5 85.65,4.47 JP12.1 | 61.67,34.95 C9.1 | 93.88,36.07 93.98,36.17 JP5.2
  Bottom 0.406: 93.98,42.57 91.94,44.62 83.43,44.62 81.99,43.18 C5.1
  Bottom 0.61: U8.62 IC2.7 83.19,19.68 83.19,21.64 IC3.7 83.19,35.88 | 83.19,35.88 70.48,35.88 70.48,35.78 | 70.48,35.78 IC1.7 | 61.67,50.8 64.72,53.85 64.72,56.49 | C13.1 C14.- | 61.67,34.95 62.5,35.78 70.48,35.78 | 93.88,36.07 83.41,36.07 83.19,35.88
GND_1  (via drill 0.7)
  Top 0.305: U7.1 5.69,73.05 5.69,75.49 U7.2 5.79,75.69 7.01,76.91 10.77,76.91 | C7.1 26.62,38.51 25.91,39.22 25.91,43.18 25.81,43.28 U$2.12 25.7,43.38 25.7,53.24 24.99,53.95 24.99,54.36 U$2.34 24.99,54.56 24.89,54.66 24.89,56.79 23.06,58.62 23.06,59.54 23.98,60.45 v24.13,60.64 | U7.5 10.77,73.25 10.77,75.49 U7.6 10.77,75.69 10.77,76.91 | 10.77,76.91 10.77,81.28 JP11.1
  Top 0.61: C20.1 25.08,60.64 v24.13,60.64 | v10.79,60.64 U7.5
  Bottom 0.61: v24.13,60.64 v10.79,60.64
HOLD
  Top 0.305: U8.8 12.7,15.24 12.7,16.87 9.45,20.12 9.45,27.33 7.01,29.77 JP10.1
HSYN2
  Bottom 0.305: U8.52 69.29,14.63 70.51,15.85 79.86,15.85 80.67,15.04 80.67,13.31 93.98,13.31 JP2.5
HSYNC
  Bottom 0.305: U7.60 79.45,75.59 79.45,79.55 92.35,79.55 94.79,77.11 95.61,77.11 98.35,74.37 98.35,61.37 96.93,61.37 VGA1.13
INT
  Top 0.305: U8.12 11.48,21.54 11.48,30.38 7.01,34.85 JP10.5
JOY1[0]
  Bottom 0.305: JP11.6 22.25,81.28 22.25,74.27 21.03,73.05 U7.13
JOY1[1]
  Bottom 0.305: U7.10 17.17,74.27 18.9,74.27 19.71,75.08 19.71,81.28 JP11.5
JOY1[2]
  Top 0.305: U7.9 14.63,74.27 14.63,82.6 15.34,83.31 18.39,83.31 18.39,81.28 JP11.4
JOY1[3]
  Top 0.305: U7.11 17.17,74.27 17.17,80.06 15.95,81.28 JP11.3
JOY1[4]
  Bottom 0.305: U7.12 13.41,80.57 13.41,81.28 JP11.2
JOY2[0]
  Top 0.305: U8.35 48.87,11.99 41.96,5.08 41.96,4.47 JP13.6
JOY2[1]  (via drill 0.41)
  Top 0.305: v47.65,7.62 44.5,4.47 JP13.5
  Bottom 0.305: v47.65,7.62 47.65,13.31 48.87,14.53 U8.36
JOY2[2]
  Bottom 0.305: U8.37 54.05,9.45 54.05,6.5 55.07,6.5 55.88,5.69 55.88,2.44 48.97,2.44 47.04,4.37 JP13.4
JOY2[3]
  Top 0.305: U8.38 51.41,14.53 50.19,13.31 50.19,5.08 49.58,4.47 JP13.3
JOY2[4]
  Top 0.305: U8.39 53.95,11.99 53.34,11.38 53.34,5.69 52.12,4.47 JP13.2
KCLK
  Top 0.305: R14.1 12.7,65.43 12.09,66.04 12.09,74.27 13.31,75.49 U7.8
KDATA
  Top 0.305: U7.7 13.82,72.54 13.82,64.01 12.7,62.89 R13.1
LDAC  (via drill 0.41)
  Top 0.305: IC2.5 76.91,19.71 78.03,20.83 78.03,31.09 IC3.5 | v55.68,68.99 55.68,48.56 58.62,45.62 58.62,34.24 59.74,33.12 65.33,33.12 65.33,33.63 IC1.5
  Bottom 0.305: IC1.5 67.77,31.29 77.93,31.29 IC3.5 | v55.68,68.99 57.61,68.99 61.57,72.95 U7.45
MISO
  Top 0.305: U8.59 80.06,11.38 80.06,4.98 80.57,4.47 JP12.3
MOSI
  Top 0.305: U8.57 78.03,10.87 78.03,4.47 JP12.4
MOSI2  (via drill 0.41)
  Top 0.305: v61.77,70.61 64.11,72.95 U7.47
  Bottom 0.305: v61.77,70.61 61.77,66.14 68.07,59.84 71.02,59.84 71.02,55.37 70.41,54.76 68.68,54.76 68.68,53.75 64.62,49.68 60.45,49.68 60.45,39.52 61.16,38.81 62.89,38.81 65.33,41.25 IC1.4
MOSI3  (via drill 0.41)
  Top 0.305: v55.58,47.35 54.76,48.16 54.76,69.49 57.81,72.54 57.81,73.56 58.52,74.27 59.94,74.27 59.94,74.57 60.86,75.49 61.57,75.49 U7.46
  Bottom 0.305: IC2.4 75.49,28.65 70.41,28.65 70.1,28.96 63.09,28.96 61.47,30.58 61.47,33.73 61.16,33.73 57.71,37.19 57.71,47.35 v55.58,47.35
MOSI4
  Top 0.305: IC3.4 78.03,38.71 77.52,38.2 77.52,35.87 72.64,30.99 71.02,30.99 71.02,29.67 70.31,28.96 68.48,28.96 68.48,29.97 66.65,31.8 57.71,31.8 57.71,39.73 55.17,42.27 55.17,46.43 54.15,47.45 54.15,71.42 55.27,72.54 55.27,76.1 55.98,76.81 64.11,76.81 64.11,75.59 U7.48
N$1  (via drill 0.41)
  Top 0.305: R1.2 77.52,50.8 77.52,53.34 R2.2 77.52,53.44 77.52,55.88 R3.2 77.52,55.98 77.52,58.42 R4.2 77.42,58.42 73.66,62.18 C1.2 | v88.8,59.74 88.8,60.66 91.75,63.6 VGA1.2
  Bottom 0.305: 96.01,22.96 95.3,22.25 95.2,22.25 93.98,21.03 JP2.2 | 96.01,46.02 92.15,46.02 87.88,50.29 78.03,50.29 77.52,50.8 R1.2 | v88.8,59.74 88.59,59.54 78.64,59.54 77.52,58.42 R4.2
  Bottom 0.406: 96.01,46.02 96.01,22.96
N$2
  Bottom 0.305: R28.2 72.75,27.23 79.35,20.62 79.35,19.71 IC2.6
N$3
  Top 0.305: U$1.5 45.72,21.03 48.26,23.57 U$1.3 48.16,28.65 47.75,29.06 47.75,34.34 48.87,35.46 R27.1 R26.2
  Bottom 0.305: C19.2 45.41,40.23 48.87,36.78 48.87,35.56 R27.1
N$4
  Top 0.305: R15.1 C15.2
N$5
  Bottom 0.305: IC3.8 85.75,31.19 88.19,33.63 93.98,33.63 JP5.1
N$6  (via drill 0.41)
  Top 0.305: R6.2 87.68,48.97 87.68,51.41 R7.2 87.68,51.51 87.68,53.95 R8.2 | JP2.3 93.98,18.49 89.41,18.49 89.41,44.6 87.68,46.33 R5.2 | VGA1.3 90.22,59.74 v90.22,55.47
  Bottom 0.305: 86.36,47.55 86.46,47.55 87.58,46.43 R5.2 | 86.36,47.55 76.2,47.55 C2.2 | R6.2 87.58,48.87 86.36,47.65 86.36,47.55 | v90.22,55.47 88.8,54.05 87.68,54.05 R8.2
N$7
  Bottom 0.305: IC2.8 84.53,19.71 85.24,20.42 88.7,20.42 91.95,23.67 91.95,27.23 93.98,27.23 JP4.1
N$8  (via drill 0.41)
  Top 0.305: v79.45,42.37 76.91,39.83 76.91,37.59 73.05,33.73 IC1.8
  Bottom 0.305: v79.45,42.37 79.76,42.06 91.95,42.06 93.98,40.03 JP3.1
N$9
  Top 0.305: C21.2 74.17,20.83 74.17,28.35 72.75,29.77 R28.1
N$10
  Top 0.305: JP2.1 93.98,23.57 90.02,27.53 90.02,54.36 87.78,56.59 87.78,58.32 R9.2 87.68,58.42 87.68,60.96 R10.2 87.68,61.06 87.68,63.5 R11.2 87.68,63.6 87.68,66.04 R12.2 87.78,65.94 91.75,65.94 VGA1.1
  Bottom 0.305: C3.2 76.91,66.65 77.72,65.84 78.54,65.84 79.45,64.92 86.46,64.92 87.58,66.04 R12.2
N$11
  Bottom 0.305: U$1.1 53.34,28.65 53.65,28.96 57.61,28.96 58.32,29.67 58.32,32.31 56.59,32.31 R19.2 56.49,32.51 56.49,34.85 R24.1
N$12
  Top 0.305: JP7.1 22.86,6.5 25.91,6.5 26.62,5.79 26.62,1.83 4.37,1.83 2.23,3.96 2.23,59.94 5.08,62.79 R13.2
N$13
  Top 0.305: JP7.2 25.4,2.44 10.26,2.44 9.55,3.15 9.55,4.57 7.01,7.11 7.01,23.47 5.69,24.79 5.69,35.36 6.2,35.87 6.2,64.21 5.08,65.33 R14.2
N$14  (via drill 0.41)
  Top 0.305: v38.51,33.02 38.51,21.03 37.49,20.02 37.49,4.47 JP9.1
  Bottom 0.305: 42.16,32.99 C8.-
  Bottom 0.406: v38.51,33.02 C8.-
N$15
  Bottom 0.305: R20.2 55.27,7.62 58.42,4.47 59.64,4.47 JP8.1
N$17
  Top 0.305: R21.2 65.33,7.62 62.28,4.57 62.28,4.47 JP8.2
N$18
  Bottom 0.305: R22.2 75.08,8.74 69.09,8.74 64.82,4.47 JP8.3
N$19
  Top 0.305: R23.2 54.46,34.44 54.46,24.69 50.8,21.03 U$1.7
  Bottom 0.305: 53.95,34.95 R23.2
  Bottom 0.406: C8.+ 46.94,33.02 48.06,34.14 52.73,34.14 53.54,34.95 53.95,34.95
N$20
  Top 0.305: U$1.6 48.26,21.03 52.22,24.99 52.22,34.75 52.83,35.36 52.83,41.35 53.95,42.47 R23.1
  Bottom 0.305: R23.1 54.05,42.57 56.49,42.57 R24.2 56.49,42.67 56.49,45.72 C11.1
N$21
  Top 0.305: C16.2 66.65,24.79 66.65,27.53 R16.1
N$22
  Top 0.305: C17.2 60.35,24.79 60.35,27.53 R17.1
N$23
  Top 0.305: C18.2 57.2,24.79 57.2,27.53 R18.1
N$25
  Top 0.305: C22.2 69.9,19.71 71.02,20.83 71.02,26.42 69.9,27.53 R29.1
N$26
  Top 0.305: R29.2 69.8,30.18 67.97,32 67.97,33.63 IC1.6
NOISEO
  Bottom 0.305: U8.47 62.89,13.31 60.35,13.31 60.35,16.46 57.2,19.61 C18.1
PB  (via drill 0.41)
  Top 0.305: v80.87,67.56 81.18,67.26 81.18,52.63 80.06,51.51 R7.1
  Bottom 0.305: v80.87,67.56 78.13,70.31 78.13,76.81 70.51,76.81 69.29,75.59 U7.52
PG  (via drill 0.41)
  Top 0.305: v60.86,69.6 70.51,69.6 70.51,74.27 71.73,75.49 U7.54
  Bottom 0.305: v60.86,69.6 60.86,64.82 69.8,55.88 R3.1
PR
  Bottom 0.305: R11.1 79.96,63.5 78.23,65.23 70.81,65.23 69.29,66.75 69.29,72.95 U7.51
R  (via drill 0.41)
  Top 0.305: v78.84,67.56 78.84,59.54 79.96,58.42 R9.1
  Bottom 0.305: v78.84,67.56 78.84,68.68 76.91,70.61 76.91,72.95 U7.57
RD
  Top 0.305: U8.10 10.67,19.81 10.67,28.65 7.01,32.31 JP10.3
RESET
  Top 0.305: U8.7 12.09,13.31 12.09,16.56 8.33,20.32 8.33,23.47 R25.1
  Bottom 0.305: R25.1 8.23,23.47 4.47,23.47 JP6.1
RTC_CE
  Bottom 0.305: R20.1 62.89,7.62 66.04,10.77 72.24,10.77 73.05,11.58 73.05,14.53 74.27,14.53 U8.56
RTC_CLK
  Top 0.305: R22.1 80.67,10.77 80.67,13.31 U8.60
RTC_DATA
  Top 0.305: R21.1 73.05,7.62 73.05,12.6 73.76,13.31 76.81,13.31 76.81,14.53 U8.58
RW2  (via drill 0.41)
  Top 0.305: v29.67,26.92 29.67,43.18 29.77,43.28 U$2.17
  Bottom 0.305: v29.67,26.92 34.24,22.35 38.2,22.35 45.92,14.63 46.33,14.63 U8.34
RX
  Top 0.305: U8.9 15.85,11.99 13.41,9.55 13.41,4.47 JP1.2
RX2
  Top 0.305: JP15.3 50.8,77.42 48.97,75.59 U7.36
SCLK
  Top 0.305: U8.55 75.08,11.28 75.08,4.88 75.49,4.47 JP12.5
SCLK2
  Top 0.305: IC2.3 79.45,27.33 79.45,37.59 80.57,38.71 IC3.3 | U7.50 66.65,75.49 65.43,74.27 60.55,74.27 60.55,73.76 60.35,73.56 60.35,72.34 56.29,68.28 56.29,48.87 59.23,45.92 59.23,34.54 60.05,33.73 64.21,33.73 64.21,37.59 67.87,41.25 IC1.3
  Bottom 0.305: IC1.3 72.34,36.88 78.74,36.88 80.57,38.71 IC3.3
SPICS
  Top 0.305: U8.53 71.83,11.99 71.83,5.59 72.95,4.47 JP12.6
SPICS2  (via drill 0.41)
  Top 0.305: IC2.2 81.99,27.33 81.99,37.59 83.11,38.71 IC3.2 83.01,38.81 80.77,41.05 80.77,43.28 72.44,43.28 | 72.44,43.28 70.51,41.35 IC1.2 | v66.65,65.33 66.24,64.92 66.24,49.48 72.44,43.28
  Bottom 0.305: v66.65,65.33 66.65,72.95 U7.49
TX
  Top 0.305: U8.11 18.39,11.99 15.95,9.55 15.95,4.47 JP1.3
TX2
  Top 0.305: U7.35 47.65,74.27 47.65,79.96 48.26,80.57 JP15.2
VSYN2
  Top 0.305: U8.51 70.9,10.38 70.9,3.44 71.91,2.44 87.72,2.44 87.72,4.51 93.98,10.77 JP2.6
VSYNC  (via drill 0.41)
  Top 0.305: v88.8,74.27 94.59,68.48 98.35,68.48 98.35,60.55 96.93,59.13 VGA1.14
  Bottom 0.305: v88.8,74.27 80.67,74.27 79.45,73.05 U7.59